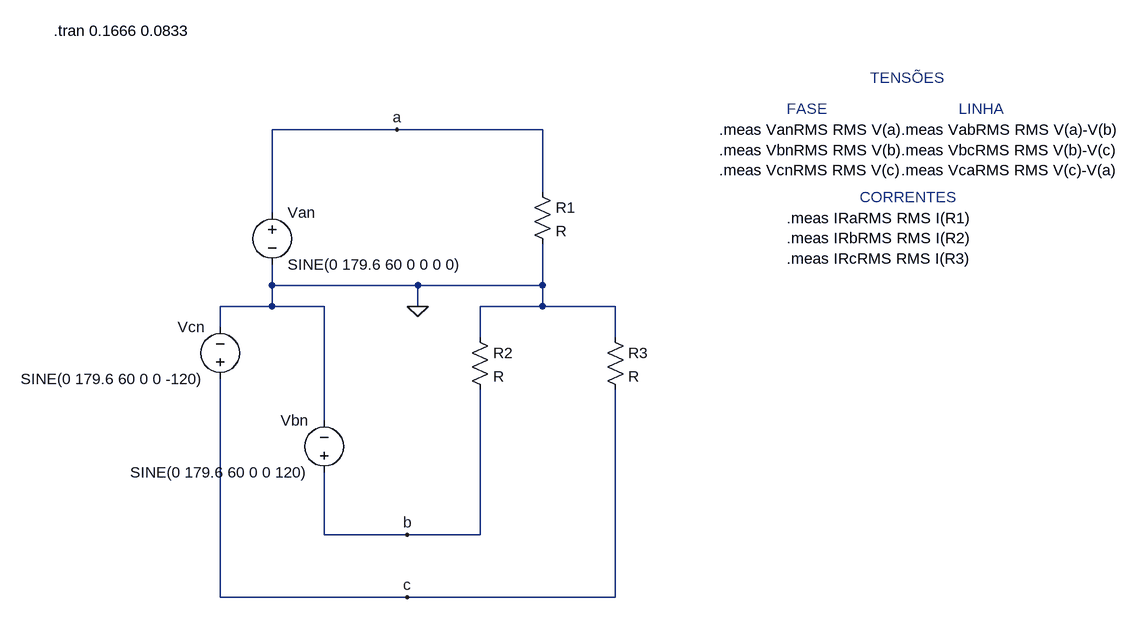
[diagram p0: schematic lab 3 .asc]
lab 3 .asc, the LTspice schematic file:
Version 4.1
SHEET 1 1332 700
WIRE 208 -64 16 -64
WIRE 432 -64 208 -64
WIRE 432 32 432 -64
WIRE 16 64 16 -64
WIRE 16 176 16 144
WIRE 240 176 16 176
WIRE 432 176 432 112
WIRE 432 176 240 176
WIRE 16 208 16 176
WIRE 16 208 -64 208
WIRE 96 208 16 208
WIRE 240 208 240 176
WIRE 432 208 432 176
WIRE 432 208 336 208
WIRE 544 208 432 208
WIRE -64 240 -64 208
WIRE 336 256 336 208
WIRE 544 256 544 208
WIRE 96 384 96 208
WIRE 96 560 96 464
WIRE 224 560 96 560
WIRE 336 560 336 336
WIRE 336 560 224 560
WIRE -64 656 -64 320
WIRE 224 656 -64 656
WIRE 544 656 544 336
WIRE 544 656 224 656
FLAG 208 -64 a
FLAG 224 560 b
FLAG 224 656 c
FLAG 240 208 0
SYMBOL voltage 16 48 R0
WINDOW 123 0 0 Left 0
WINDOW 39 0 0 Left 0
SYMATTR InstName Van
SYMATTR Value SINE(0 179.6 60 0 0 0 0)
SYMBOL voltage 96 480 R180
WINDOW 0 24 96 Left 2
WINDOW 3 24 16 Left 2
WINDOW 123 0 0 Left 0
WINDOW 39 0 0 Left 0
SYMATTR InstName Vbn
SYMATTR Value SINE(0 179.6 60 0 0 120)
SYMBOL voltage -64 336 R180
WINDOW 0 24 96 Left 2
WINDOW 3 24 16 Left 2
WINDOW 123 0 0 Left 0
WINDOW 39 0 0 Left 0
SYMATTR InstName Vcn
SYMATTR Value SINE(0 179.6 60 0 0 -120)
SYMBOL res 416 16 R0
SYMATTR InstName R1
SYMBOL res 320 240 R0
SYMATTR InstName R2
SYMBOL res 528 240 R0
SYMATTR InstName R3
TEXT -320 -216 Left 2 !.tran 0.1666 0.0833
TEXT 704 -64 Left 2 !.meas VanRMS RMS V(a)\n.meas VbnRMS RMS V(b)\n.meas VcnRMS RMS V(c)
TEXT 936 -144 Left 2 ;TENSÕES
TEXT 808 -96 Left 2 ;FASE
TEXT 1072 -96 Left 2 ;LINHA
TEXT 984 -64 Left 2 !.meas VabRMS RMS V(a)-V(b)\n.meas VbcRMS RMS V(b)-V(c)\n.meas VcaRMS RMS V(c)-V(a)
TEXT 920 40 Left 2 ;CORRENTES
TEXT 808 72 Left 2 !.meas IRaRMS RMS I(R1)\n.meas IRbRMS RMS I(R2)\n.meas IRcRMS RMS I(R3)

The netlist it stands for:
* lab 3 .asc
Van a 0 SINE(0 179.6 60 0 0 0 0)
Vbn b 0 SINE(0 179.6 60 0 0 120)
Vcn c 0 SINE(0 179.6 60 0 0 -120)
R1 a 0 R
R2 0 b R
R3 0 c R
.tran 0.1666 0.0833
.meas VanRMS RMS V(a)
.meas VbnRMS RMS V(b)
.meas VcnRMS RMS V(c)
* TENSÕES
* FASE
* LINHA
.meas VabRMS RMS V(a)-V(b)
.meas VbcRMS RMS V(b)-V(c)
.meas VcaRMS RMS V(c)-V(a)
* CORRENTES
.meas IRaRMS RMS I(R1)
.meas IRbRMS RMS I(R2)
.meas IRcRMS RMS I(R3)
.backanno
.end